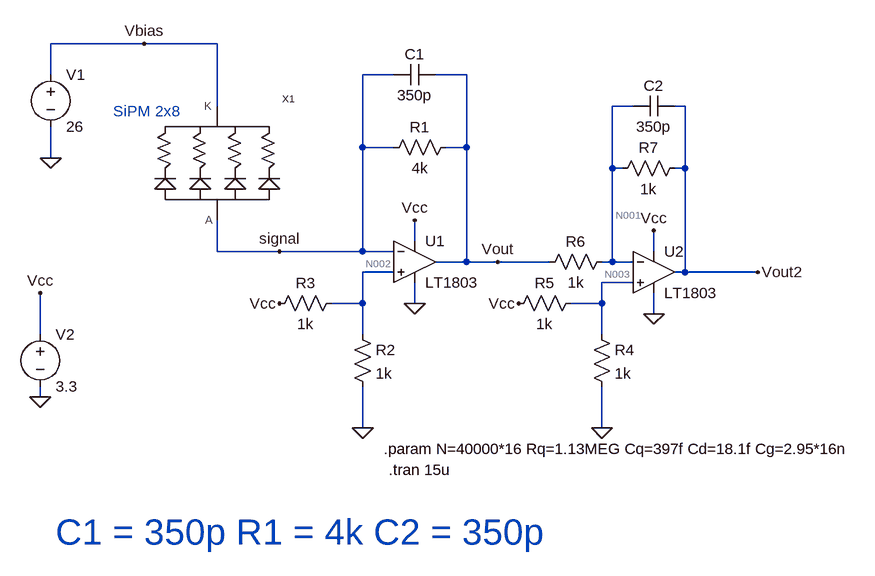
[diagram p0: schematic currentmode.asc]
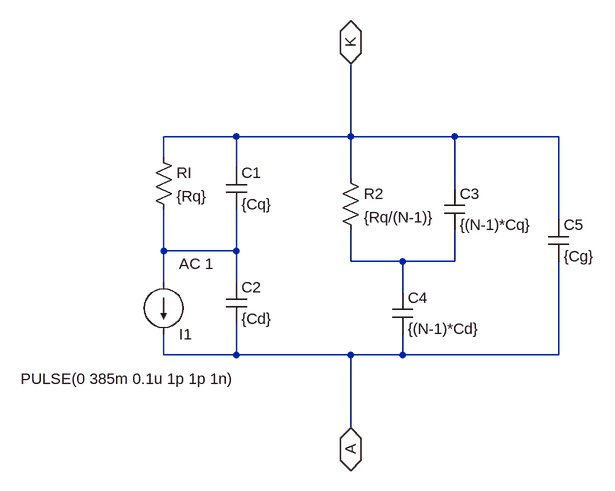
[diagram p1: sub-circuit sipm_equivalente_controllo_tensione_pulse.asc]
* currentmode.asc
V1 Vbias 0 26
V2 Vcc 0 3.3
X§X1 Vbias signal sipm_equivalente_controllo_tensione_pulse
R1 Vout signal 4k
C1 Vout signal 350p
* U1: LT1803 (symbol OpAmps\LT1803 not available, pins judged from their places): In+=N002 In-=signal V+=Vcc V-=0 OUT=Vout
R2 N002 0 1k
R3 N002 Vcc 1k
* U2: LT1803 (symbol OpAmps\LT1803 not available, pins judged from their places): In+=N003 In-=N001 V+=Vcc V-=0 OUT=Vout2
R4 N003 0 1k
R5 N003 Vcc 1k
R6 N001 Vout 1k
R7 Vout2 N001 1k
C2 Vout2 N001 350p

* block symbol definitions
.subckt sipm_equivalente_controllo_tensione_pulse K A
RI K N001 {Rq}
R2 K N002 {Rq/(N-1)}
C1 K N001 {Cq}
C2 N001 A {Cd}
C3 K N002 {(N-1)*Cq}
C4 N002 A {(N-1)*Cd}
C5 K A {Cg}
I1 N001 A PULSE(0 385m 0.1u 1p 1p 1n) AC 1
.ends sipm_equivalente_controllo_tensione_pulse

.tran 15u
.param N=40000*16 Rq=1.13MEG Cq=397f Cd=18.1f Cg=2.95*16n
* C1 = 350p R1 = 4k C2 = 350p
* SiPM 2x8
.backanno
.end

* Results of the author's LTspice run, read from the files saved beside the schematic
* Operating Point, zero values left out:
*   V(n001) = 1.65 V
*   V(n002) = 1.649 V
*   V(n003) = 1.649 V
*   V(signal) = 1.65 V
*   V(vbias) = 26 V
*   V(vcc) = 3.3 V
*   V(vout) = 1.659 V
*   V(vout2) = 1.643 V
*   I(R1) = 2.325 µA
*   I(R2) = 1.649 mA
*   I(R3) = -1.651 mA
*   I(R4) = 1.649 mA
*   I(R5) = -1.651 mA
*   I(R6) = -9.301 µA
*   I(R7) = -6.976 µA
*   I(V2) = -9.102 mA
*   Ix(u1:1) = 2.425 µA
*   Ix(u1:2) = 2.325 µA
*   Ix(u1:3) = 2.9 mA
*   Ix(u1:4) = -2.9 mA
*   Ix(u1:5) = -11.63 µA
*   Ix(u2:1) = 2.425 µA
*   Ix(u2:2) = 2.325 µA
*   Ix(u2:3) = 2.9 mA
*   Ix(u2:4) = -2.9 mA
*   Ix(u2:5) = 6.976 µA
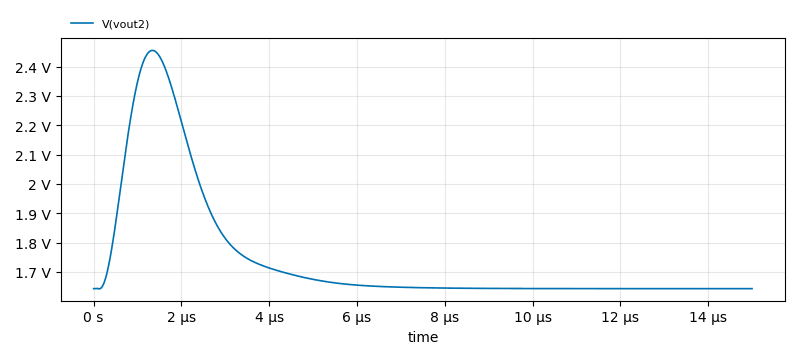
[diagram p2: Transient Analysis of currentmode.asc, plotted from the saved traces]
* Transient Analysis, 1 run:
*   V(vout2): min 1.642 V, max 2.456 V, average 1.746 V, rms 1.758 V, last 1.643 V